# Altium schematic sheet FLASH_M25PX0_SPI_8Mbit.SchDoc: Host - Dual Serial Flash Memory
size A4; Organization: Altium Limited.; Address1: Level 3, 12a Rodborough Rd; Address2: Frenchs Forest 2086; Address3: NSW; Address4: AUSTRALIA; DocumentNumber: 48; SheetNumber: 49; SheetTotal: 77
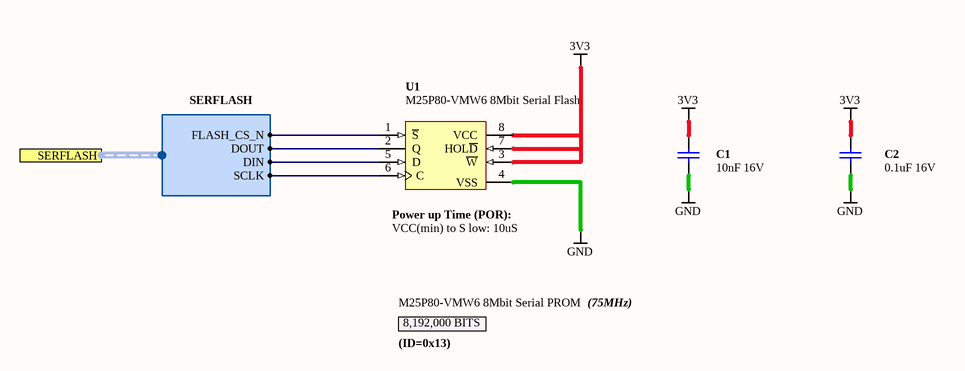
[diagram p0: FLASH_M25PX0_SPI_8Mbit.SchDoc]

## Parts
C1  10nF 16V  [CAPC1005-STAR]
C2  0.1uF 16V  [CAPC1005-STAR]
U1  M25P80-VMW6 8Mbit Serial Flash  [SOIC8-200-BODY]

## Ports
SERFLASH (harness SERFLASH)

## Harnesses
SERFLASH: DIN, DOUT, SCLK, FLASH_CS_N

## Nets
3V3: C1.1 C2.2 U1.3(~{W}) U1.7(HOL~{D}) U1.8(VCC)
GND: C1.2 C2.1 U1.4(VSS)
NetU1_1: U1.1(~{S}) ; port SERFLASH.FLASH_CS_N
NetU1_2: U1.2(Q) ; port SERFLASH.DOUT
NetU1_5: U1.5(D) ; port SERFLASH.DIN
NetU1_6: U1.6(C) ; port SERFLASH.SCLK

## Notes on the sheet
- (near U1) Power up Time (POR):
- (near U1) VCC(min) to S low: 10uS
- (ID=0x13)
- M25P80-VMW6 8Mbit Serial PROM
- 8,192,000 BITS
- (75MHz)
- Sheet Title
- Project Title
- Size:
- Date:
- A4
- Assy:
- Time:
- Revision:
- Sheet
- of
- File:

## Library data of the parts
C1 = D-101-0077: Capacitor, Ceramic, 10nF 10% 16V 0402 (1005) X7R; Polarity: Non-Polarized; Category: Capacitor; Capacitance: 10 nF; Dielectric: X7R; Mounting Technology: Surface Mount; Rated Voltage: 16 V; Status: Production; Technology: Ceramic; Tolerance: 10 %
C2 = D-101-0080: Capacitor, Ceramic, 0.1uF 10% 16V 0402 (1005) X7R; Polarity: Non-Polarized; Category: Capacitor; Capacitance: 0.1 uF; Dielectric: X7R; Mounting Technology: Surface Mount; Rated Voltage: 16 V; Status: Production; Technology: Ceramic; Tolerance: 10 %
U1 = D-262-0006: Bit Length: Bits; Speed: ps; Supply Voltage: mV; Category: IC-Flash; Bit Width: Bits; Mounting Technology: Surface Mount; Status: Unreleased